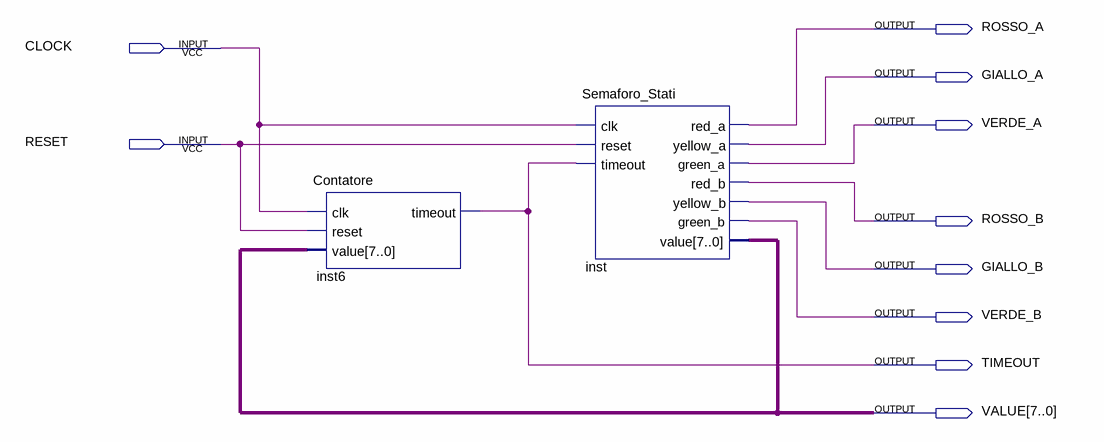
[diagram p0: schematic sheet]
// Quartus schematic SEMAFORO.bdf as structural Verilog: 2 symbols, 10 pins
module SEMAFORO (
  input  CLOCK,
  input  RESET,
  output ROSSO_A,
  output GIALLO_A,
  output VERDE_A,
  output ROSSO_B,
  output GIALLO_B,
  output VERDE_B,
  output TIMEOUT,
  output [7:0] VALUE
);

  Contatore inst6 (.clk(CLOCK), .reset(RESET), .value(VALUE), .timeout(TIMEOUT));
  Semaforo_Stati inst (
    .clk(CLOCK), .reset(RESET), .timeout(TIMEOUT), .red_a(ROSSO_A), .yellow_a(GIALLO_A), .green_a(VERDE_A),
    .red_b(ROSSO_B), .yellow_b(GIALLO_B), .green_b(VERDE_B), .value(VALUE));
endmodule
